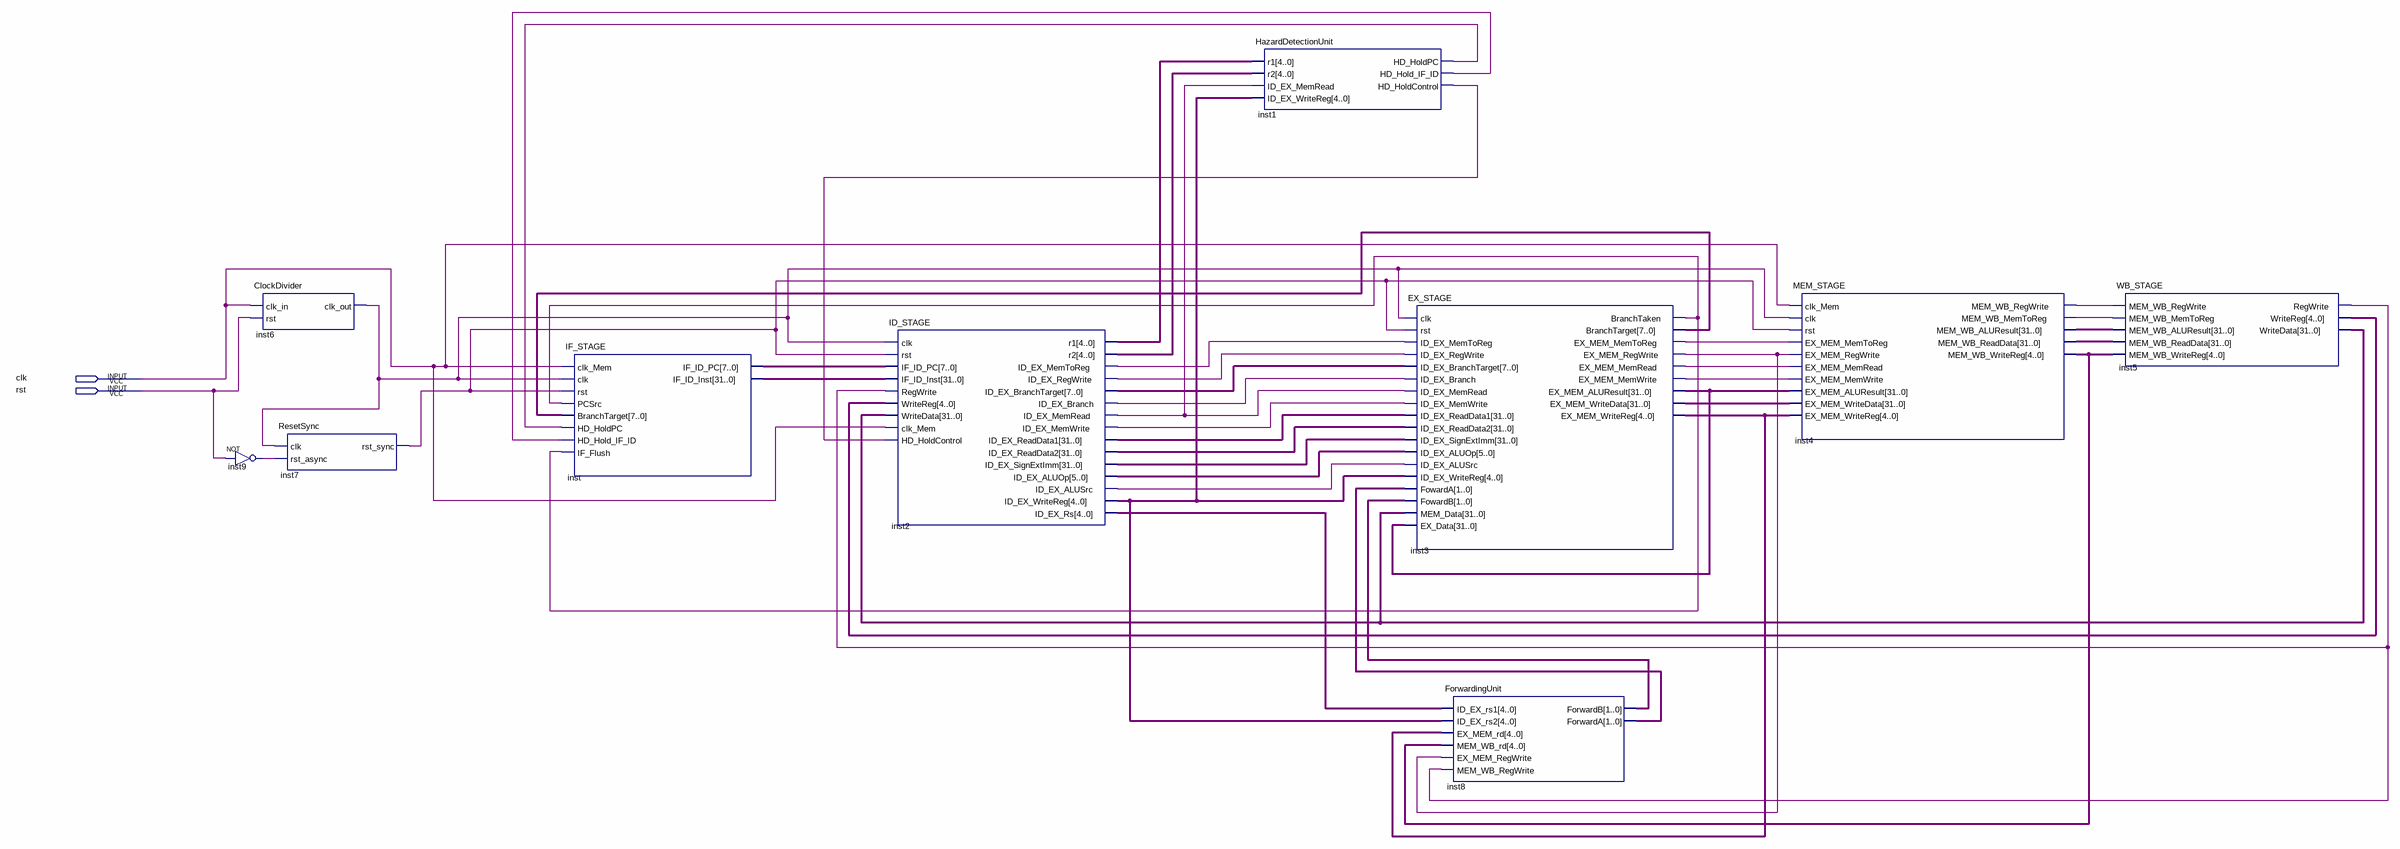
[diagram p0: schematic sheet]
// Quartus schematic ModuloProcessador.bdf as structural Verilog: 10 symbols, 2 pins
module ModuloProcessador (
  input  clk,
  input  rst
);

  wire inst1_hd_hold_if_id, inst1_hd_holdcontrol, inst1_hd_holdpc, inst2_id_ex_alusrc, inst2_id_ex_branch,
       inst2_id_ex_memread, inst2_id_ex_memtoreg, inst2_id_ex_memwrite, inst2_id_ex_regwrite,
       inst3_branchtaken, inst3_ex_mem_memread, inst3_ex_mem_memtoreg, inst3_ex_mem_memwrite,
       inst3_ex_mem_regwrite, inst4_mem_wb_memtoreg, inst4_mem_wb_regwrite, inst5_regwrite, inst6_clk_out,
       inst7_rst_sync, inst9_out;
  wire [1:0] inst8_forwarda, inst8_forwardb;
  wire [4:0] inst2_id_ex_rs, inst2_id_ex_writereg, inst2_r1, inst2_r2, inst3_ex_mem_writereg,
       inst4_mem_wb_writereg, inst5_writereg;
  wire [5:0] inst2_id_ex_aluop;
  wire [7:0] inst2_id_ex_branchtarget, inst3_branchtarget, inst_if_id_pc;
  wire [31:0] inst2_id_ex_readdata1, inst2_id_ex_readdata2, inst2_id_ex_signextimm, inst3_ex_mem_aluresult,
       inst3_ex_mem_writedata, inst4_mem_wb_aluresult, inst4_mem_wb_readdata, inst5_writedata,
       inst_if_id_inst;

  ClockDivider inst6 (.clk_in(clk), .rst(rst), .clk_out(inst6_clk_out));
  not inst9 (inst9_out, rst);
  ResetSync inst7 (.clk(inst6_clk_out), .rst_async(inst9_out), .rst_sync(inst7_rst_sync));
  IF_STAGE inst (
    .clk_Mem(clk), .clk(inst6_clk_out), .rst(inst7_rst_sync), .PCSrc(inst3_branchtaken),
    .BranchTarget(inst3_branchtarget), .HD_HoldPC(inst1_hd_holdpc), .HD_Hold_IF_ID(inst1_hd_hold_if_id),
    .IF_Flush(inst3_branchtaken), .IF_ID_PC(inst_if_id_pc), .IF_ID_Inst(inst_if_id_inst));
  ID_STAGE inst2 (
    .clk(inst6_clk_out), .rst(inst7_rst_sync), .IF_ID_PC(inst_if_id_pc), .IF_ID_Inst(inst_if_id_inst),
    .RegWrite(inst5_regwrite), .WriteReg(inst5_writereg), .WriteData(inst5_writedata), .clk_Mem(clk),
    .HD_HoldControl(inst1_hd_holdcontrol), .r1(inst2_r1), .r2(inst2_r2),
    .ID_EX_MemToReg(inst2_id_ex_memtoreg), .ID_EX_RegWrite(inst2_id_ex_regwrite),
    .ID_EX_BranchTarget(inst2_id_ex_branchtarget), .ID_EX_Branch(inst2_id_ex_branch),
    .ID_EX_MemRead(inst2_id_ex_memread), .ID_EX_MemWrite(inst2_id_ex_memwrite),
    .ID_EX_ReadData1(inst2_id_ex_readdata1), .ID_EX_ReadData2(inst2_id_ex_readdata2),
    .ID_EX_SignExtImm(inst2_id_ex_signextimm), .ID_EX_ALUOp(inst2_id_ex_aluop),
    .ID_EX_ALUSrc(inst2_id_ex_alusrc), .ID_EX_WriteReg(inst2_id_ex_writereg), .ID_EX_Rs(inst2_id_ex_rs));
  HazardDetectionUnit inst1 (
    .r1(inst2_r1), .r2(inst2_r2), .ID_EX_MemRead(inst2_id_ex_memread), .ID_EX_WriteReg(inst2_id_ex_writereg),
    .HD_HoldPC(inst1_hd_holdpc), .HD_Hold_IF_ID(inst1_hd_hold_if_id), .HD_HoldControl(inst1_hd_holdcontrol));
  EX_STAGE inst3 (
    .clk(inst6_clk_out), .rst(inst7_rst_sync), .ID_EX_MemToReg(inst2_id_ex_memtoreg),
    .ID_EX_RegWrite(inst2_id_ex_regwrite), .ID_EX_BranchTarget(inst2_id_ex_branchtarget),
    .ID_EX_Branch(inst2_id_ex_branch), .ID_EX_MemRead(inst2_id_ex_memread),
    .ID_EX_MemWrite(inst2_id_ex_memwrite), .ID_EX_ReadData1(inst2_id_ex_readdata1),
    .ID_EX_ReadData2(inst2_id_ex_readdata2), .ID_EX_SignExtImm(inst2_id_ex_signextimm),
    .ID_EX_ALUOp(inst2_id_ex_aluop), .ID_EX_ALUSrc(inst2_id_ex_alusrc),
    .ID_EX_WriteReg(inst2_id_ex_writereg), .FowardA(inst8_forwarda), .FowardB(inst8_forwardb),
    .MEM_Data(inst5_writedata), .EX_Data(inst3_ex_mem_aluresult), .BranchTaken(inst3_branchtaken),
    .BranchTarget(inst3_branchtarget), .EX_MEM_MemToReg(inst3_ex_mem_memtoreg),
    .EX_MEM_RegWrite(inst3_ex_mem_regwrite), .EX_MEM_MemRead(inst3_ex_mem_memread),
    .EX_MEM_MemWrite(inst3_ex_mem_memwrite), .EX_MEM_ALUResult(inst3_ex_mem_aluresult),
    .EX_MEM_WriteData(inst3_ex_mem_writedata), .EX_MEM_WriteReg(inst3_ex_mem_writereg));
  ForwardingUnit inst8 (
    .ID_EX_rs1(inst2_id_ex_rs), .ID_EX_rs2(inst2_id_ex_writereg), .EX_MEM_rd(inst3_ex_mem_writereg),
    .MEM_WB_rd(inst4_mem_wb_writereg), .EX_MEM_RegWrite(inst3_ex_mem_regwrite),
    .MEM_WB_RegWrite(inst5_regwrite), .ForwardB(inst8_forwardb), .ForwardA(inst8_forwarda));
  MEM_STAGE inst4 (
    .clk_Mem(clk), .clk(inst6_clk_out), .rst(inst7_rst_sync), .EX_MEM_MemToReg(inst3_ex_mem_memtoreg),
    .EX_MEM_RegWrite(inst3_ex_mem_regwrite), .EX_MEM_MemRead(inst3_ex_mem_memread),
    .EX_MEM_MemWrite(inst3_ex_mem_memwrite), .EX_MEM_ALUResult(inst3_ex_mem_aluresult),
    .EX_MEM_WriteData(inst3_ex_mem_writedata), .EX_MEM_WriteReg(inst3_ex_mem_writereg),
    .MEM_WB_RegWrite(inst4_mem_wb_regwrite), .MEM_WB_MemToReg(inst4_mem_wb_memtoreg),
    .MEM_WB_ALUResult(inst4_mem_wb_aluresult), .MEM_WB_ReadData(inst4_mem_wb_readdata),
    .MEM_WB_WriteReg(inst4_mem_wb_writereg));
  WB_STAGE inst5 (
    .MEM_WB_RegWrite(inst4_mem_wb_regwrite), .MEM_WB_MemToReg(inst4_mem_wb_memtoreg),
    .MEM_WB_ALUResult(inst4_mem_wb_aluresult), .MEM_WB_ReadData(inst4_mem_wb_readdata),
    .MEM_WB_WriteReg(inst4_mem_wb_writereg), .RegWrite(inst5_regwrite), .WriteReg(inst5_writereg),
    .WriteData(inst5_writedata));
endmodule
